# EAGLE design clock_divider (EAGLE 8.0.1)
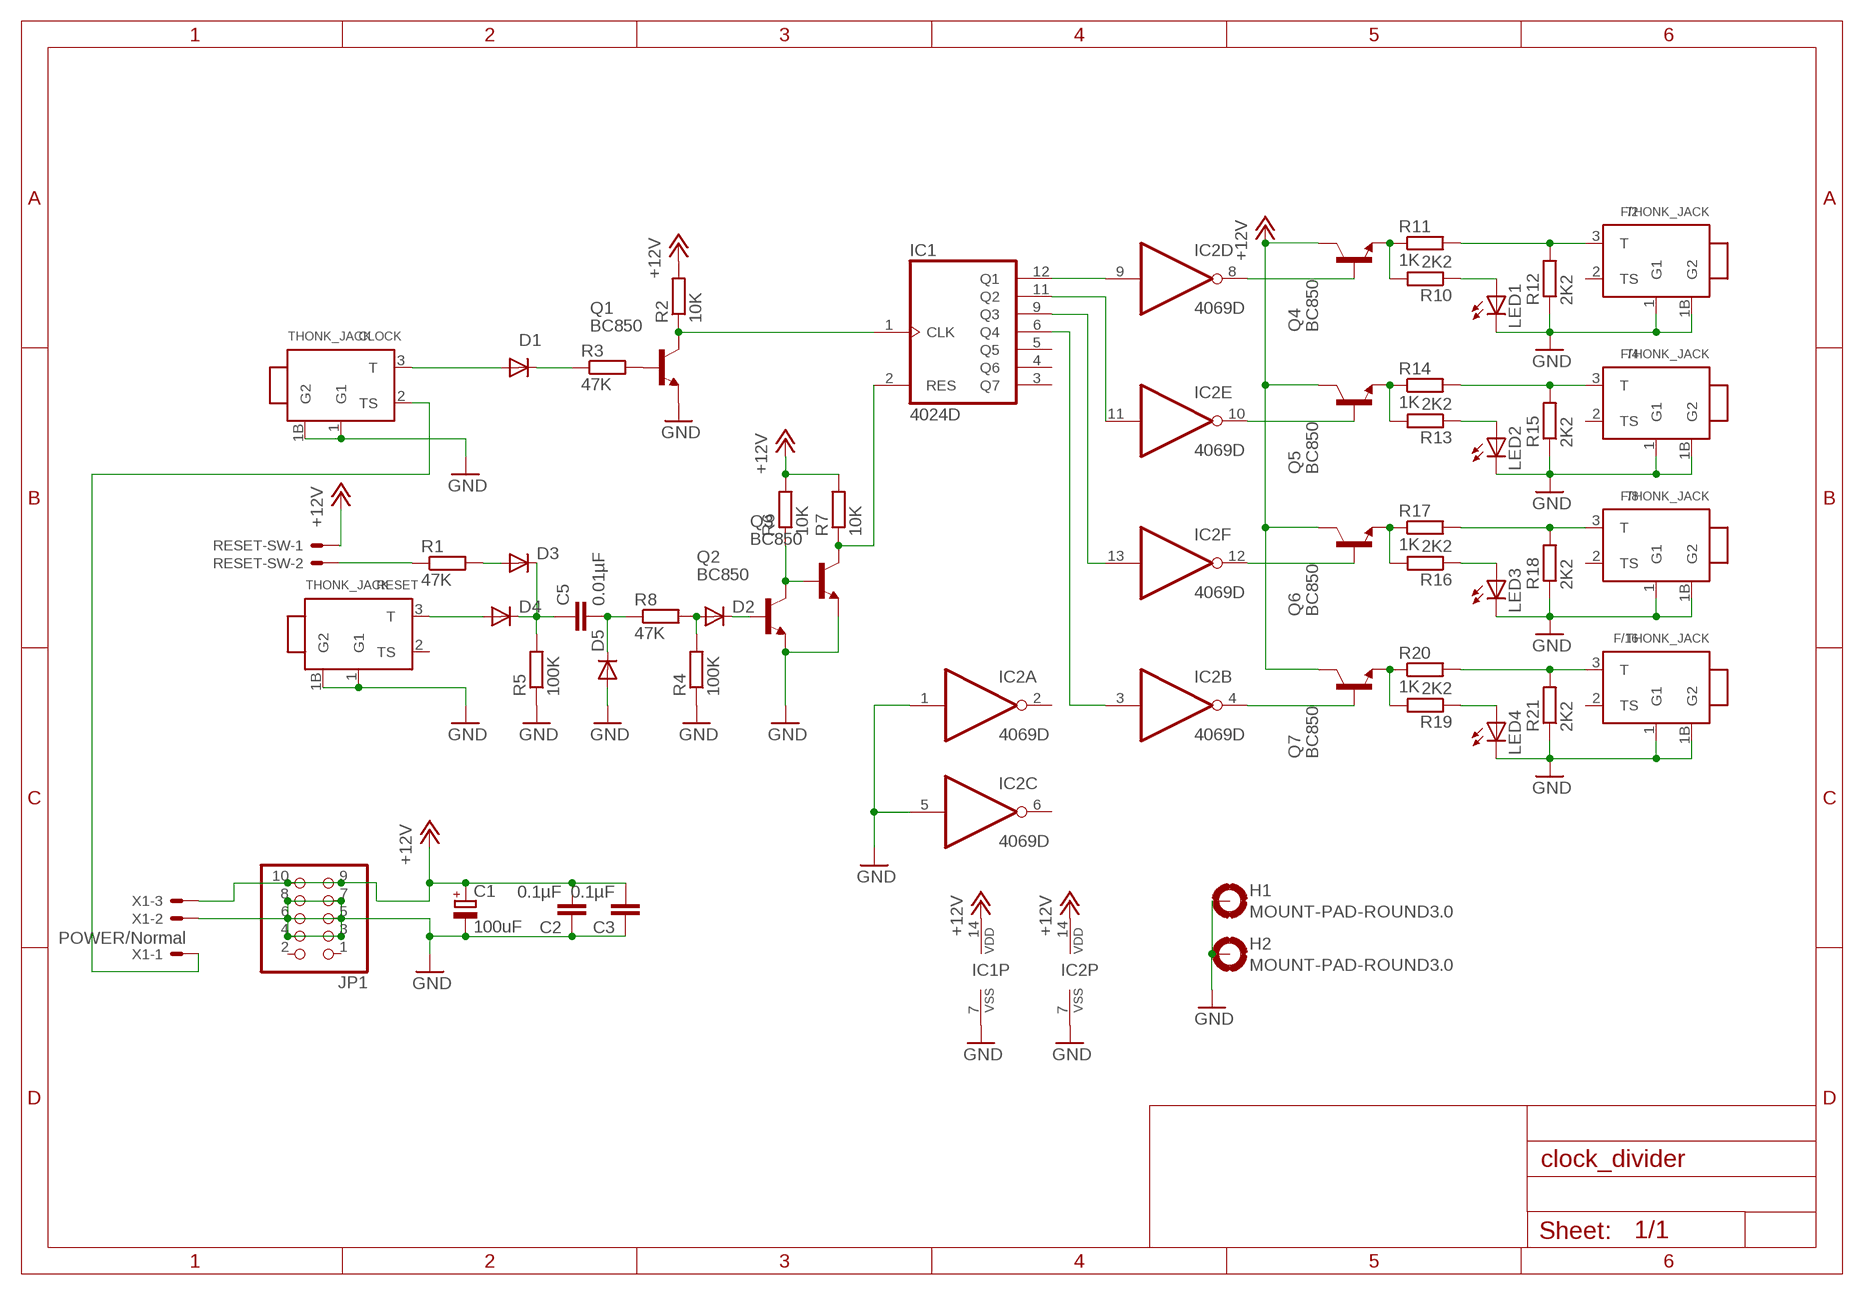
[diagram p0: schematic, sheet 1]

## Parts
C1  100uF  CPOL-EUE2,5-6E  [E2,5-6E]
C2  0.1µF  C-EUC0805  [C0805]
C3  0.1µF  C-EUC0805  [C0805]
C5  0.01µF  C-EUC0805  [C0805]
CLOCK  THONK_JACK  [THONK_JACK_P]
D1  1N4148  1N4148DO35-7  [DO35-7]
D2  1N4148  1N4148DO35-7  [DO35-7]
D3  1N4148  1N4148DO35-7  [DO35-7]
D4  1N4148  1N4148DO35-7  [DO35-7]
D5  1N4148  1N4148DO35-7  [DO35-7]
F/2  THONK_JACK  [THONK_JACK_P]
F/4  THONK_JACK  [THONK_JACK_P]
F/8  THONK_JACK  [THONK_JACK_P]
F/16  THONK_JACK  [THONK_JACK_P]
H1  MOUNT-PAD-ROUND3.0  [3,0-PAD]
H2  MOUNT-PAD-ROUND3.0  [3,0-PAD]
IC1  4024D  [SO14]
IC2  4069D  [SO14]
JP1  PINHD-2X5  [2X05]
LED1  LED5MM  [LED5MM]
LED2  LED5MM  [LED5MM]
LED3  LED5MM  [LED5MM]
LED4  LED5MM  [LED5MM]
Q1  BC850  [SOT23]
Q2  BC850  [SOT23]
Q3  BC850  [SOT23]
Q4  BC850  [SOT23]
Q5  BC850  [SOT23]
Q6  BC850  [SOT23]
Q7  BC850  [SOT23]
R1  47K  R-EU_M0805  [M0805]
R2  10K  R-EU_M0805  [M0805]
R3  47K  R-EU_M0805  [M0805]
R4  100K  R-EU_M0805  [M0805]
R5  100K  R-EU_M0805  [M0805]
R6  10K  R-EU_M0805  [M0805]
R7  10K  R-EU_M0805  [M0805]
R8  47K  R-EU_M0805  [M0805]
R10  2K2  R-EU_M0805  [M0805]
R11  1K  R-EU_M0805  [M0805]
R12  2K2  R-EU_M0805  [M0805]
R13  2K2  R-EU_M0805  [M0805]
R14  1K  R-EU_M0805  [M0805]
R15  2K2  R-EU_M0805  [M0805]
R16  2K2  R-EU_M0805  [M0805]
R17  1K  R-EU_M0805  [M0805]
R18  2K2  R-EU_M0805  [M0805]
R19  2K2  R-EU_M0805  [M0805]
R20  1K  R-EU_M0805  [M0805]
R21  2K2  R-EU_M0805  [M0805]
RESET  THONK_JACK  [THONK_JACK_P]
RESET-SW  KK-156-2  [KK-156-2]
X1  POWER/Normal  KK-156-3  [KK-156-3]

## Nets
+12V: C1.+ C2.2 C3.2 IC1.14(VDD) IC2.14(P:VDD) JP1.9 JP1.10 Q4.3(C) Q5.3(C) Q6.3(C) Q7.3(C) R2.2 R6.2 R7.2 RESET-SW.1 X1.3
GND: C1.- C2.1 C3.1 CLOCK.1(G1) CLOCK.1B(G2) D5.A F/2.1(G1) F/2.1B(G2) F/4.1(G1) F/4.1B(G2) F/8.1(G1) F/8.1B(G2) F/16.1(G1) F/16.1B(G2) H1.B3,0(MOUNT) H2.B3,0(MOUNT) IC1.7(VSS) IC2.1(A:I) IC2.5(C:I) IC2.7(P:VSS) JP1.3 JP1.4 JP1.5 JP1.6 JP1.7 JP1.8 LED1.K(C) LED2.K(C) LED3.K(C) LED4.K(C) Q1.2(E) Q2.2(E) Q3.2(E) R4.1 R5.1 R12.1 R15.1 R18.1 R21.1 RESET.1(G1) RESET.1B(G2) X1.2
N$1: Q4.2(E) R10.2 R11.1
N$2: IC1.12(Q1) IC2.9(D:I)
N$3: IC1.11(Q2) IC2.11(E:I)
N$4: Q1.1(B) R3.2
N$5: IC1.1(CLK) Q1.3(C) R2.1
N$6: D1.C R3.1
N$7: CLOCK.3(T) D1.A
N$8: D4.A RESET.3(T)
N$9: C5.1 D3.C D4.C R5.2
N$10: C5.2 D5.C R8.1
N$11: D2.A R4.2 R8.2
N$12: D2.C Q2.1(B)
N$13: Q2.3(C) Q3.1(B) R6.1
N$14: IC1.2(RES) Q3.3(C) R7.1
N$15: IC1.9(Q3) IC2.13(F:I)
N$16: IC1.6(Q4) IC2.3(B:I)
N$17: LED2.A R13.1
N$18: IC2.8(D:O) Q4.1(B)
N$19: LED4.A R19.1
N$20: F/4.3(T) R14.2 R15.2
N$21: Q5.2(E) R13.2 R14.1
N$22: IC2.10(E:O) Q5.1(B)
N$23: F/8.3(T) R17.2 R18.2
N$24: Q6.2(E) R16.2 R17.1
N$25: IC2.12(F:O) Q6.1(B)
N$26: F/16.3(T) R20.2 R21.2
N$27: Q7.2(E) R19.2 R20.1
N$28: IC2.4(B:O) Q7.1(B)
N$30: LED3.A R16.1
N$31: LED1.A R10.1
N$33: D3.A R1.2
N$34: R1.1 RESET-SW.2
N$35: CLOCK.2(TS) X1.1
N$42: F/2.3(T) R11.2 R12.2
Unconnected: F/2.2(TS) F/4.2(TS) F/8.2(TS) F/16.2(TS) IC1.3(Q7) IC1.4(Q6) IC1.5(Q5) IC2.2(A:O) IC2.6(C:O) JP1.1 JP1.2 RESET.2(TS)

## Library data of the parts
C1 = rcl:CPOL-EU: POLARIZED CAPACITOR, European symbol
C2 C3 C5 = rcl:C-EU: CAPACITOR, European symbol
CLOCK F/2 F/4 F/8 F/16 RESET = crows_thonk_pj301bm:THONK_JACK
D1-D5 = diode:1N4148: DIODE high speed (Philips)
H1 H2 = holes:MOUNT-PAD-ROUND: MOUNTING PAD, round
IC1 = 40xx:4024: 7-stage binary/ripple COUNTER
IC2 = 40xx:4069: Hex INVERTER
JP1 = pinhead:PINHD-2X5: PIN HEADER
LED1-LED4 = led:LED: LED OSRAM: - CHIPLED LG R971, LG N971, LY N971, LG Q971, LY Q971, LO R971, LY R971 LH N974, LH R974 LS Q976, LO Q976, LY Q976 LO Q996 - Hyper CHIPLED LW Q18S LB Q993, LB Q99A, LB R99A - SideLED LS A670, LO A670, LY A670, LG A670, LP A670 LB A673, LV A673, LT A673, LW A673 LH A674 LY A675 LS A676, LA A676, LO A676, LY A676, LW A676 LS A679, LY A679, LG A679 - Hyper Micro SIDELED® LS Y876, LA Y876, LO Y876, LY Y876 LT Y87S - SmartLED LW L88C, LW L88S LB L89C, LB L89S, LG L890 LS L89K, LO L89K, LY L89K LS L896, LA L896, LO L896, LY L896 - TOPLED LS T670, LO T670, LY T670, LG T670, LP T670 LSG T670, LSP T670, LSY T670, LOP T670, LYG T670 LG T671, LOG T671, LSG T671 LB T673, LV T673, LT T673, LW T673 LH T674 LS T676, LA T676, LO T676, LY T676, LB T676, LH T676, LSB T676, LW T676 LB T67C, LV T67C, LT T67C, LS T67K, LO T67K, LY T67K, LW E67C LS E67B, LA E67B, LO E67B, LY E67B, LB E67C, LV E67C, LT E67C LW T67C LS T679, LY T679, LG T679 LS T770, LO T770, LY T770, LG T770, LP T770 LB T773, LV T773, LT T773, LW T773 LH T774 LS E675, LA E675, LY E675, LS T675 LS T776, LA T776, LO T776, LY T776, LB T776 LHGB T686 LT T68C, LB T68C - Hyper Mini TOPLED® LB M676 - Mini TOPLED Santana® LG M470 LS M47K, LO M47K, LY M47K Source: http://www.osram.convergy.de LUXEON: - LUMILED® LXK2-PW12-R00, LXK2-PW12-S00, LXK2-PW14-U00, LXK2-PW14-V00 LXK2-PM12-R00, LXK2-PM12-S00, LXK2-PM14-U00 LXK2-PE12-Q00, LXK2-PE12-R00, LXK2-PE12-S00, LXK2-PE14-T00, LXK2-PE14-U00 LXK2-PB12-K00, LXK2-PB12-L00, LXK2-PB12-M00, LXK2-PB14-N00, LXK2-PB14-P00, LXK2-PB14-Q00 LXK2-PR12-L00, LXK2-PR12-M00, LXK2-PR14-Q00, LXK2-PR14-R00 LXK2-PD12-Q00, LXK2-PD12-R00, LXK2-PD12-S00 LXK2-PH12-R00, LXK2-PH12-S00 LXK2-PL12-P00, LXK2-PL12-Q00, LXK2-PL12-R00 Source: www.luxeon.com KINGBRIGHT: KA-3528ASYC Source: www.kingbright.com
Q1-Q7 = transistor:BC850: NPN TRANSISTOR
R1-R8 R10-R21 = resistor:R-EU_: RESISTOR, European symbol
RESET-SW = con-molex:KK-156-2: KK 156 HEADER Source: http://www.molex.com/pdm_docs/sd/026604100_sd.pdf; OC_FARNELL: unknown; OC_NEWARK: unknown
X1 = con-molex:KK-156-3: KK 156 HEADER Source: http://www.molex.com/pdm_docs/sd/026604100_sd.pdf; OC_FARNELL: unknown; OC_NEWARK: unknown

## Board
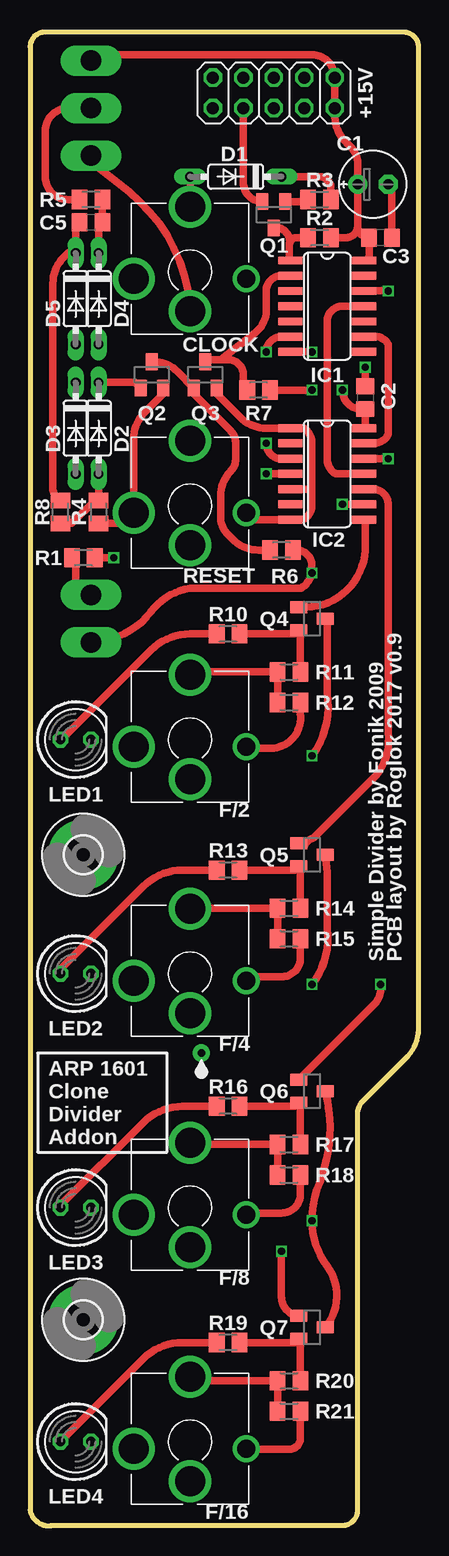
[diagram p1: board, top side]
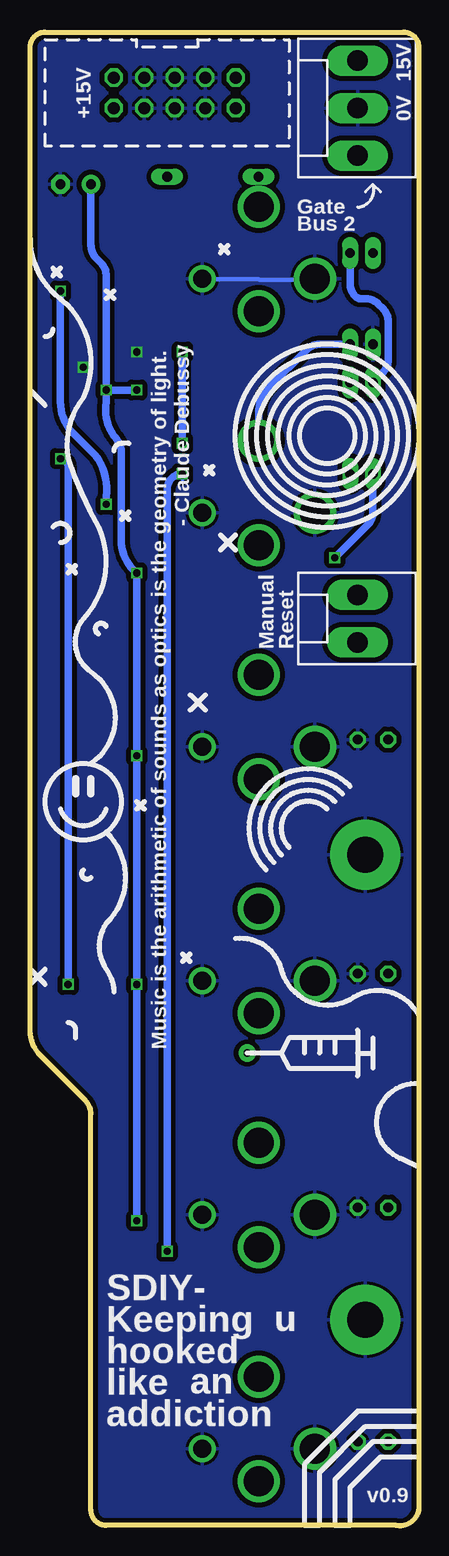
[diagram p2: board, bottom side, seen from below]

Size 32.38 x 124.48 mm. Coordinates in mm from the lower left corner, seen from the top.
Outline: 0,123.22 0,1.3 arc90 1.91,0.03 26.04,0.03 arc90 27.3,1.3 27.3,34.32 arc-45 27.75,35.41 31.3,38.95 arc45 32.38,41.31 32.38,123.21 arc90 31.11,124.48 1.26,124.48 arc90 0,123.22
Copper layers (1*16): Top 0.035mm / dielectric 1.5mm / Bottom 0.035mm
Design rules "SeeedStudio_2layer_DRU_no_angle_20140221": minimum track width 6mil, minimum drill 12mil, track to track 6mil, track to pad 6mil, pad to pad 6mil, via to via 6mil, smd to smd 0mil, copper to edge 10mil, drill to drill 10mil, minimum pad ring 10mil, minimum via ring 6mil, stop-mask expansion 2mil, vias tented up to drill 100mil, thermal gap 10mil

### Footprints (pad centres in the part's own frame; a part is rotated, then mirrored left to right if it is on the bottom)
E2,5-6E = drill 0.813 pad 1.575: + -1.27,0 | drill 0.813 pad 1.575 octagon: - 1.27,0
C0805 = smd 1.3 x 1.5: 1 -0.95,0; 2 0.95,0
THONK_JACK_P = drill 2.5: 1 -4.7,-0.6; 2 0,-3.3; 3 0,5.4 | drill 1.5: 1B 4.7,-0.6
DO35-7 = drill 0.813 long: A 3.81,0; C -3.81,0
3,0-PAD = drill 3 pad 5.842: B3,0 0,0
SO14 = smd 0.66 x 2.032: 1 -3.81,-3.073; 2 -2.54,-3.073; 3 -1.27,-3.073; 4 0,-3.073; 5 1.27,-3.073; 6 2.54,-3.073; 7 3.81,-3.073; 8 3.81,3.073; 9 2.54,3.073; 10 1.27,3.073; 11 0,3.073; 12 -1.27,3.073; 13 -2.54,3.073; 14 -3.81,3.073
2X05 = drill 1.016 octagon: 1 -5.08,-1.27; 2 -5.08,1.27; 3 -2.54,-1.27; 4 -2.54,1.27; 5 0,-1.27; 6 0,1.27; 7 2.54,-1.27; 8 2.54,1.27; 9 5.08,-1.27; 10 5.08,1.27
LED5MM = drill 0.813 octagon: A -1.27,0; K 1.27,0
SOT23 = smd 1 x 1.4: 1 -0.95,-1.1; 2 0.95,-1.1; 3 0,1.1
M0805 = smd 1.3 x 1.6: 1 -0.95,0; 2 0.95,0
KK-156-2 = drill 1.7 pad 2.184 long: 1 -1.98,0; 2 1.98,0
KK-156-3 = drill 1.7 pad 2.184 long: 1 -3.96,0; 2 0,0; 3 3.96,0

### Placement (x,y rotation side)
C1  28.57,111.79 0 top
C2  27.94,94.01 270 top
C3  29.21,107.35 180 top
C5  5.08,108.62 180 top
CLOCK  13.34,104.52 0 top
D1  17.14,112.43 180 top
D2  5.71,91.47 270 top
D3  3.81,91.47 270 top
D4  5.71,102.27 270 top
D5  3.81,102.27 270 top
F/2  13.34,65.52 0 top
F/4  13.34,46.02 0 top
F/8  13.34,26.52 0 top
F/16  13.34,7.02 0 top
H1  4.45,55.91 0 top
H2  4.45,17.18 0 top
IC1  24.77,101.63 270 top
IC2  24.77,87.66 270 top
JP1  20.32,119.41 0 top
LED1  3.81,65.52 0 top
LED2  3.81,46.02 0 top
LED3  3.81,26.52 0 top
LED4  3.81,7.02 0 top
Q1  20.32,109.25 180 top
Q2  10.16,95.92 0 top
Q3  14.61,95.92 0 top
Q4  23.5,75.6 270 top
Q5  23.5,55.91 270 top
Q6  23.5,36.23 270 top
Q7  23.5,16.54 270 top
R1  4.45,80.68 0 top
R2  24.13,107.35 0 top
R3  24.13,110.52 180 top
R4  5.71,84.49 90 top
R5  5.08,110.52 0 top
R6  20.95,81.31 0 top
R7  19.05,94.65 0 top
R8  2.54,84.49 270 top
R10  16.51,74.33 0 top
R11  21.59,71.15 180 top
R12  21.59,68.61 180 top
R13  16.51,54.64 0 top
R14  21.59,51.47 180 top
R15  21.59,48.93 180 top
R16  16.51,34.96 0 top
R17  21.59,31.78 180 top
R18  21.59,29.24 180 top
R19  16.51,15.27 0 top
R20  21.59,12.1 180 top
R21  21.59,9.56 180 top
RESET  13.34,85.02 0 top
RESET-SW  5.08,75.6 90 bottom
X1  5.08,118.14 90 bottom

### Tracks (layer width: path | path; a pad name or v marks a point on that pad's centre or on a via)
+12V  (via drill 0.6)
  Top 0.406: 27.94,91.57 IC2.14 | 22.23,81.63 R6.2 | Q6.3 24.77,34.79
  Top 0.61: 27.94,91.57 C2.2 27.62,93.06 arc-90 v26.04,94.65 | v23.5,45.12 arc45 24.77,49.72 24.77,54.47 Q5.3 | v23.5,64.17 arc45 24.77,69.4 24.77,75.43 Q4.3 | 28.31,105.44 IC1.14 | 27.3,105.44 IC1.14 | 27.3,108.3 C1.+ 27.3,113.7 arc45 26.41,115.23 arc-45 25.4,117.4 JP1.9 JP1.10 arc90 23.5,122.59 6.2,122.59 5.71,122.1 X1.3 | 27.3,108.3 arc90 C3.2 28.26,105.86 arc-90 IC1.14 | R2.2 26.35,107.35 arc90 27.3,108.3 | v23.5,94.65 R7.2 | R6.2 22.23,81.31 arc-90 23.5,80.04 v23.5,79.41 arc-45 22.6,78.14 13.34,78.14 arc45 10.08,76.15 arc-45 5.67,73.69 5.16,73.69 RESET-SW.1 | Q6.3 arc-37 24.13,28.61 arc23 v23.5,25.43 arc37 24.77,21.62 arc-77 Q7.3
  Bottom 0.61: v23.5,25.43 v23.5,45.12 v23.5,64.17 v23.5,79.41 arc45 24.77,81.84 24.77,89.3 arc-45 25.4,90.84 arc45 26.04,93.64 v26.04,94.65 | v26.04,94.65 v23.5,94.65 | v26.04,94.65 26.04,104.17 arc-45 26.48,105.26 26.86,105.63 arc45 27.3,106.71 C1.+
GND  (via drill 0.6)
  Top 0.406: 22.23,83.85 IC2.7
  Top 0.61: C2.1 v27.94,96.55 | 23.5,86.39 IC2.5 | 22.54,28.92 R18.1 22.54,27.65 arc-90 20.95,26.07 18.18,26.07 arc90 F/8.1B | 23.5,86.39 23.5,90.2 arc45 23.05,91.29 22.86,91.47 IC2.1 19.68,91.47 arc-45 17.52,92.37 15.55,94.33 Q3.2 | 23.5,86.39 23.5,85.12 arc-45 23.05,84.04 arc-45 22.6,83.85 IC2.7 18.6,83.85 RESET.1B | C3.1 30.16,111.48 arc90 C1.- | R21.1 22.54,7.33 arc-90 21.59,6.38 18.07,6.38 arc-90 F/16.1B | R15.1 22.54,47.34 arc-90 20.95,45.75 18.37,45.75 arc90 F/4.1B | R12.1 22.54,67.66 arc-90 20.32,64.8 18.15,64.8 arc-90 F/2.1B | JP1.3 17.78,111.94 arc90 Q1.2 | Q2.2 11.11,94.33 9.53,92.74 arc45 8.63,90.59 RESET.1 7.75,83.54 R4.1 | IC1.7 v23.5,97.82 | R5.1 3.17,110.52 arc-90 1.27,112.43 1.27,116.24 arc-90 3.17,118.14 X1.2
  Bottom 0.406: CLOCK.1B 8.57,103.85
  pour Bottom (isolate 0.406): 32.38,125.13 32.38,0.67 0,0.03 0,123.49 arc-90 1.64,124.49
N$1
  Top 0.61: R10.2 22.07,74.33 Q4.2 22.54,74.5 R11.1
N$2  (via drill 0.6)
  Top 0.61: IC2.9 v26.04,85.12 | IC1.12 v29.84,102.9
  Bottom 0.61: v29.84,102.9 29.84,94.01 arc-45 28.95,91.21 26.93,89.19 arc45 26.04,85.76 v26.04,85.12
N$3
  Top 0.61: IC2.11 25.66,87.66 arc-45 25.21,87.85 arc-45 24.77,88.93 24.77,100.36 arc-90 26.04,101.63 IC1.11
N$4
  Top 0.61: Q1.1 23.01,110.35 arc90 R3.2
N$5
  Top 0.406: 20.49,107.98 Q1.3
  Top 0.61: Q1.3 20.79,108.15 arc-90 21.59,106.71 | 21.59,106.71 21.59,105.54 arc90 IC1.1 | R2.1 22.23,107.35 arc90 21.59,106.71
N$6
  Top 0.61: R3.1 25.08,111.48 arc90 24.13,112.43 D1.C
N$7
  Top 0.61: D1.A CLOCK.3
N$8
  Bottom 0.61: D4.A 8.26,98.46 arc-45 9.34,98.01 12.44,94.91 arc-45 13.34,92.74 RESET.3
N$9
  Top 0.61: R5.2 C5.1 6.03,108.3 5.71,107.98 D4.C
  Bottom 0.61: D3.C 2.99,96.1 arc-45 2.54,97.19 2.54,100.36 arc-45 2.99,101.45 3.36,101.82 arc-45 4.45,102.27 4.82,102.27 arc45 5.27,102.45 arc45 5.71,103.54 D4.C 5.71,106.71
N$10
  Top 0.61: C5.2 4.13,108.3 3.81,107.98 D5.C | 3.5,106.39 D5.C | D5.C 3.17,106.08 2.8,105.7 arc45 1.91,103.54 1.91,86.33 arc45 R8.1
N$11
  Top 0.61: 5.71,85.12 5.44,85.48 3.5,83.54 R8.2 | 5.71,85.12 6.04,85.12 R4.2 | R4.2 D2.A | R4.2 5.71,85.12
N$12
  Top 0.61: D2.C 8.74,95.28 Q2.1
N$13
  Top 0.61: R6.1 19.05,81.31 arc-45 16.88,82.21 16.51,82.58 arc-45 15.88,84.11 15.88,85.87 arc-45 16.7,87.85 arc45 17.14,88.93 17.14,90.2 arc45 16.7,91.29 13.65,94.33 Q3.1 12.31,96.16 arc45 10.25,97.02 Q2.3
N$14
  Top 0.61: IC1.2 20.95,104.17 arc90 19.68,102.9 19.68,101 arc-45 18.6,99.28 15.88,97.19 | 15.88,97.19 16.51,97.19 arc-90 17.78,95.92 17.78,94.97 arc90 R7.1 | 15.88,97.19 14.78,97.19 arc90 Q3.3
N$15
  Top 0.406: IC2.13 28.57,90.2 | 28.95,99.09 IC1.9
  Top 0.61: 28.57,90.2 arc45 29.66,90.65 arc45 29.84,91.1 29.84,98.46 arc45 29.4,98.91 arc45 28.95,99.09
N$16  (via drill 0.6)
  Top 0.406: 20.95,99.09 IC1.6 | IC2.3 20.95,88.93
  Top 0.61: v19.68,97.82 arc-90 20.95,99.09 | 20.95,88.93 arc-90 v19.68,90.2
  Bottom 0.61: v19.68,97.82 v19.68,90.2
N$17
  Top 0.61: LED2.A 2.54,46.39 9.45,53.29 arc-45 12.7,54.64 R13.1
N$18
  Top 0.61: Q4.1 22.54,76.55 arc90 27.94,81.31 27.94,83.75 arc90 IC2.8
N$19
  Top 0.61: LED4.A 9.45,13.92 arc-45 12.7,15.27 R19.1
N$20
  Top 0.61: R15.2 R14.2 13.38,51.47 arc90 F/4.3
N$21
  Top 0.61: R14.1 22.54,53.37 | 22.54,53.37 22.54,53.55 | R13.2 22.07,54.64 Q5.2 22.54,54.82 22.54,53.37
N$22
  Top 0.406: 22.86,56.69 Q5.1
  Top 0.61: 22.86,56.69 arc-45 23.66,57.34 28.87,62.56 arc45 29.84,66.07 29.84,85.12 arc90 28.57,86.39 IC2.10
N$23
  Top 0.61: R18.2 R17.2 13.47,31.78 arc-90 F/8.3
N$24
  Top 0.61: R16.2 22.07,34.96 Q6.2 22.54,35.13 R17.1
N$25  (via drill 0.6)
  Top 0.61: IC2.12 v29.84,88.93 | v29.21,45.12 arc-45 28.86,43.65 Q6.1
  Bottom 0.61: v29.21,45.12 29.21,88.3 arc-90 v29.84,88.93
N$26
  Top 0.61: R21.2 R20.2 13.65,12.1 arc-90 F/16.3
N$27
  Top 0.61: R19.2 22.07,15.27 Q7.2 22.54,15.45 R20.1
N$28  (via drill 0.6)
  Top 0.61: v19.68,87.66 IC2.4 | Q7.1 22.55,17.49 arc-90 20.95,19.08 v20.95,22.89
  Bottom 0.406: v19.68,87.66 19.68,87.29
  Bottom 0.61: v20.95,22.89 20.95,86.39 arc90 v19.68,87.66
N$30
  Top 0.61: LED3.A 2.54,26.7 9.45,33.61 arc-45 12.7,34.96 R16.1
N$31
  Top 0.61: LED1.A 2.62,65.52 10.08,72.98 arc-45 13.34,74.33 R10.1
N$32  (via drill 0.6 pad 1.42)
  other vias: 14.29,39.4
N$33  (via drill 0.6)
  Top 0.61: R1.2 v6.99,80.68
  Bottom 0.61: D3.A 3.81,84.49 arc45 4.26,83.4 v6.99,80.68
N$34
  Top 0.61: RESET-SW.2 4.37,77.58 3.81,78.14 3.81,80.36 R1.1
N$35
  Top 0.61: CLOCK.2 13.34,101.85 arc45 8.26,111.16 5.23,113.55 5.08,113.7 X1.1
N$42
  Top 0.61: R12.2 R11.2 13.57,71.15 arc90 F/2.3

### Text on the board
tPlace: +15V | Simple Divider by Fonik 2009 | PCB layout by Roglok 2017 v0.9 | ARP 1601 | Clone | Divider | Addon
bPlace: 15V | +15V | 0V | Gate / Bus 2 | Music is the arithmetic of sounds as optics is the geometry of light. / - Claude Debussy | Reset | Manual | u | SDIY- / Keeping / hooked / like / addiction | an | v0.9